# EAGLE board ESP32 WATCH_V1.0 (EAGLE 9.6.2)
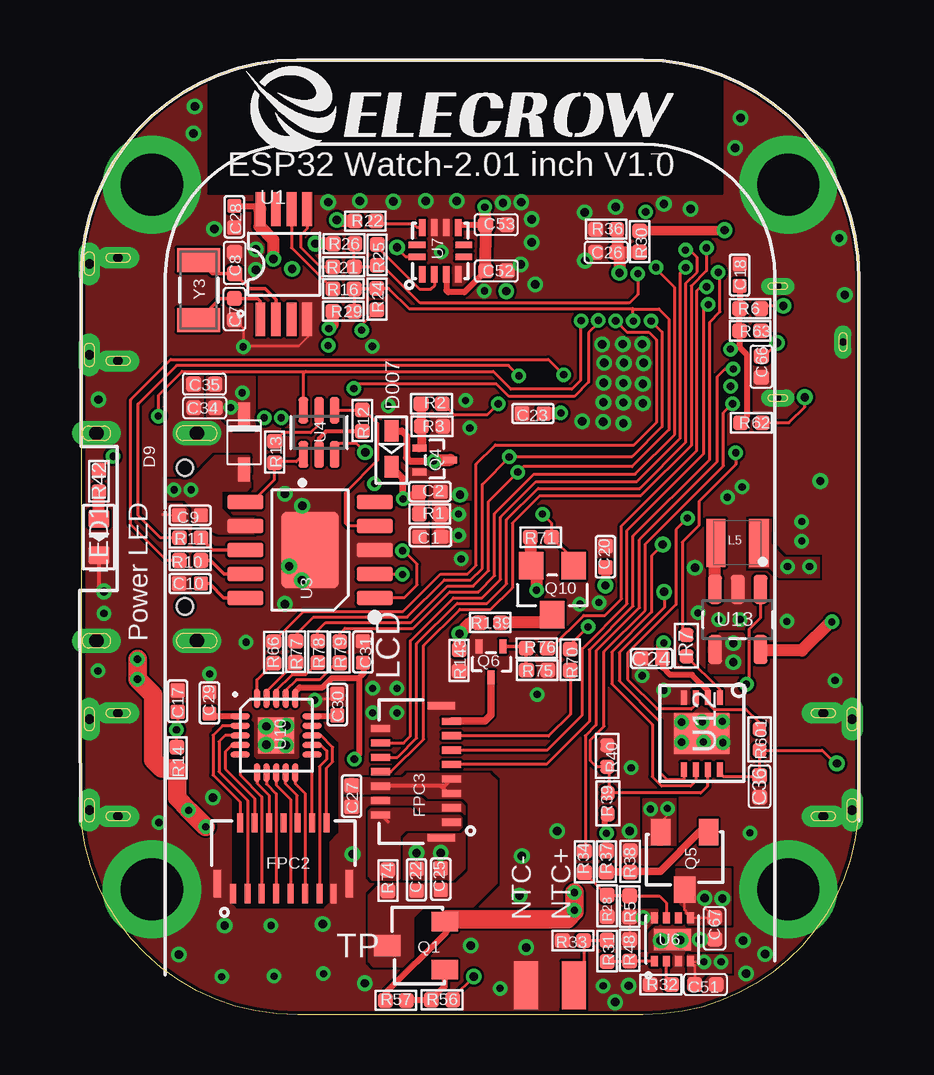
[diagram p5: board, top side]
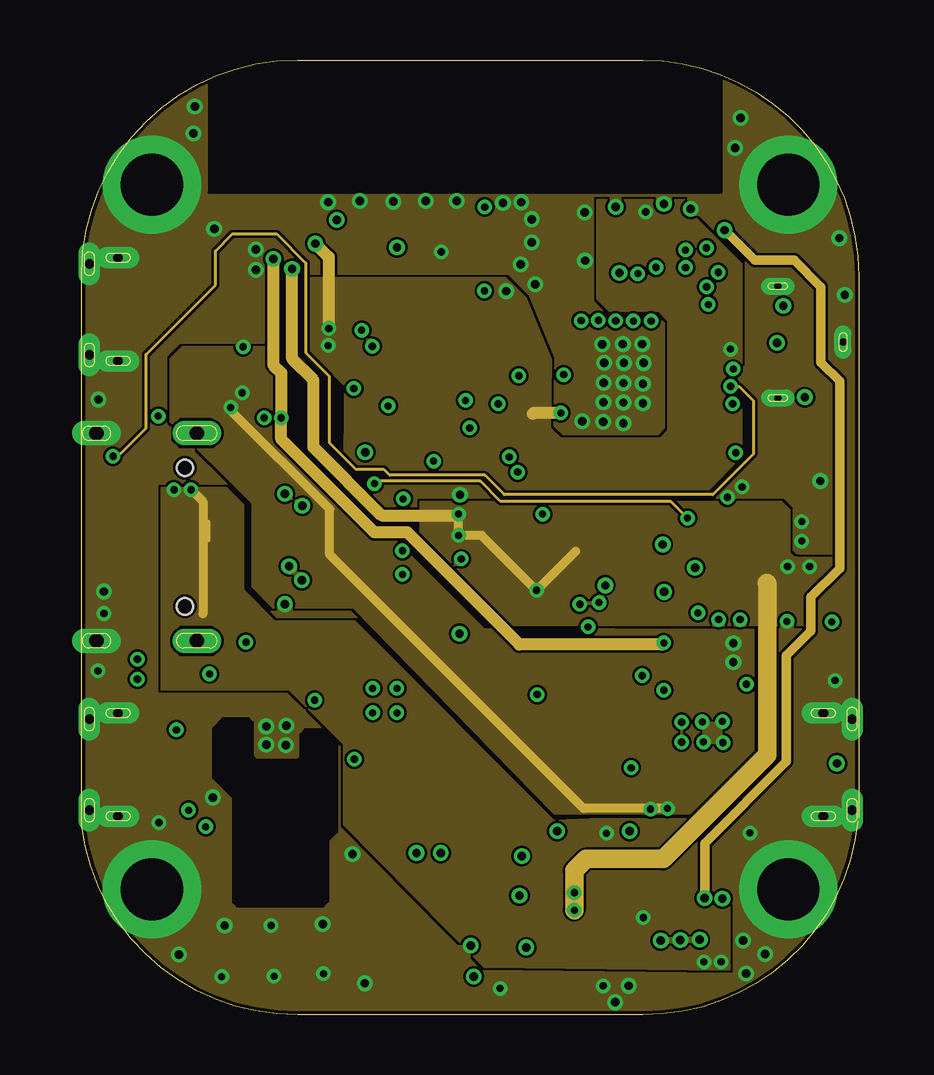
[diagram p6: board, inner layer Route2]
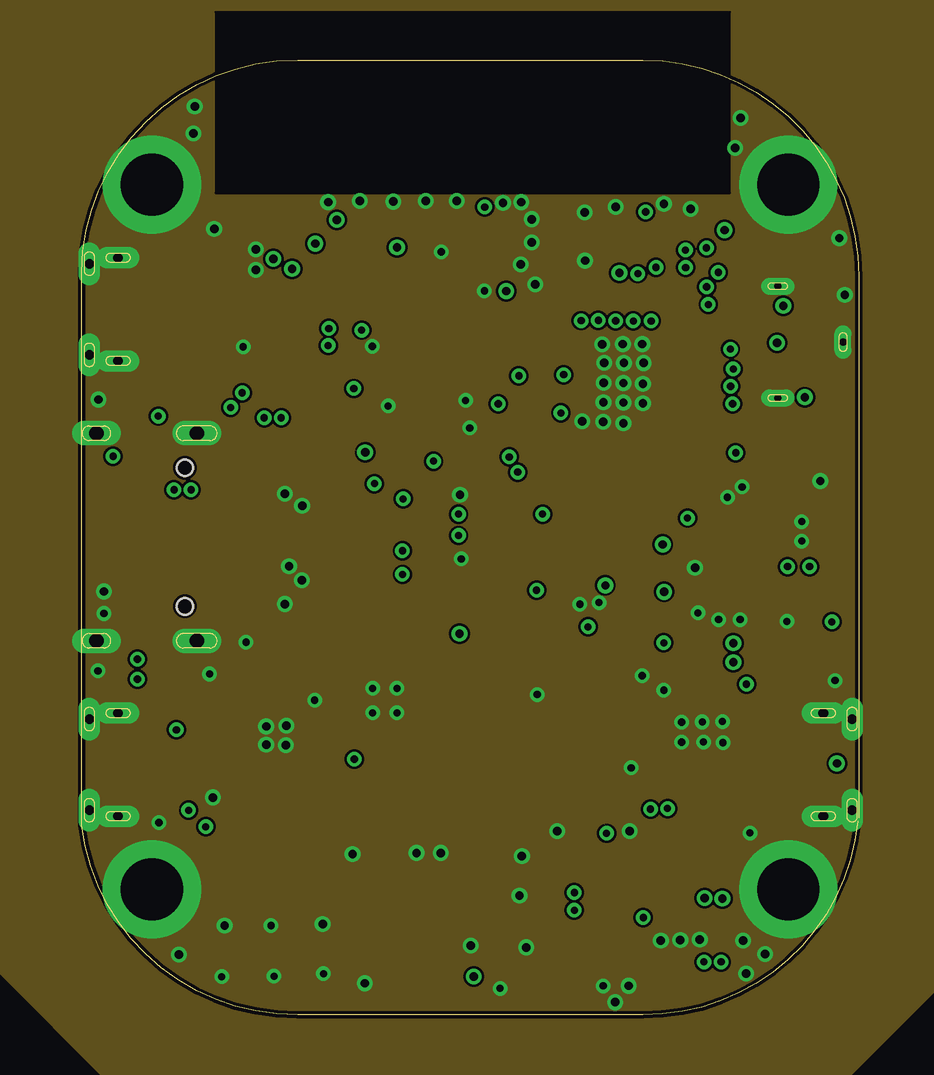
[diagram p7: board, inner layer Route15]
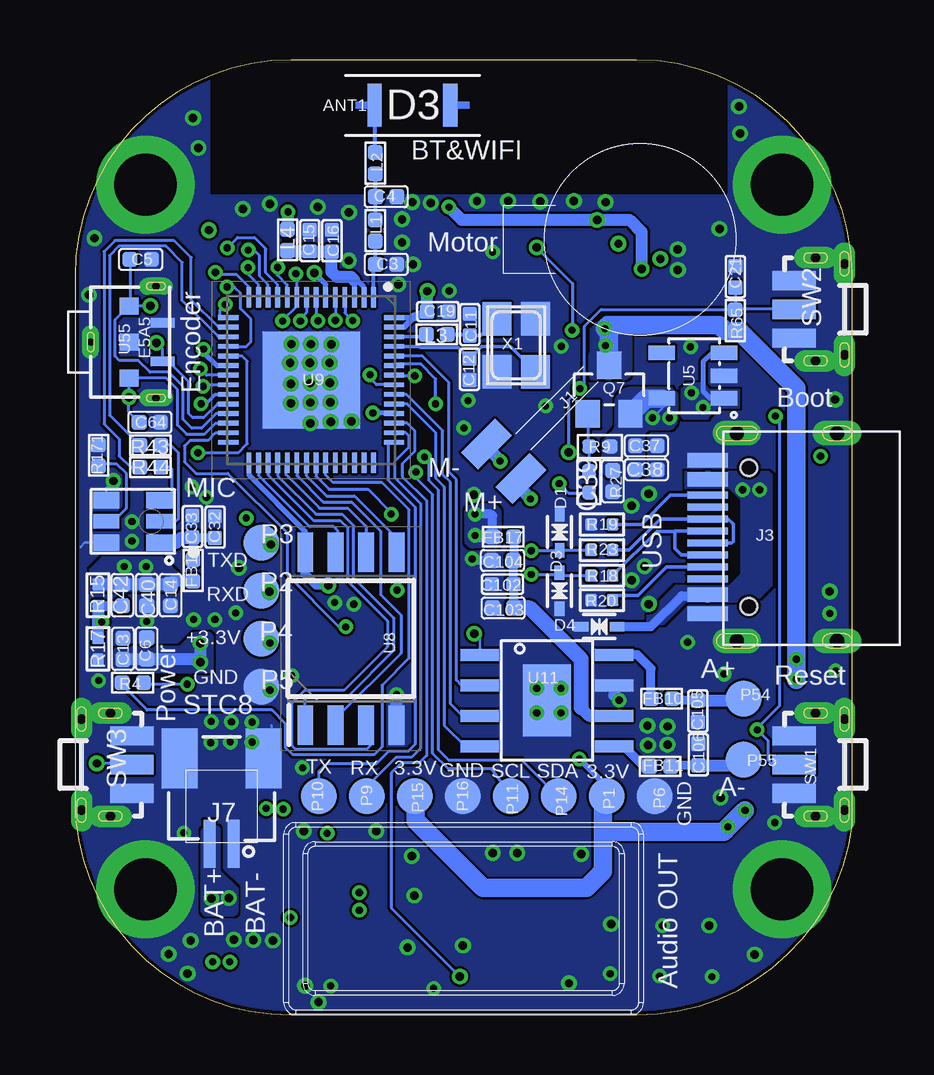
[diagram p8: board, bottom side, seen from below]

Size 32.4 x 39.8 mm. Coordinates in mm from the lower left corner, seen from the top.
Outline: 32.4,8.2 32.4,30.8 arc90 23.4,39.8 9,39.8 arc89 0,30.96
Outline: 0,30.96 0,7.9 arc83 9,0 23.4,0 arc85 32.36,8.08
Copper layers (1+2*15+16): Top 0.035mm / dielectric 1.5mm / Route2 0.035mm / dielectric 0.15mm / Route15 0.035mm / dielectric 0.2mm / Bottom 0.035mm
Design rules "default *": minimum track width 4mil, minimum drill 0.25mm, track to track 4mil, track to pad 4mil, pad to pad 4mil, via to via 4mil, smd to smd 4mil, copper to edge 6mil, drill to drill 4mil, minimum pad ring 6mil, minimum via ring 6mil, stop-mask expansion 4mil, vias tented up to drill 100mil, thermal gap 0mil
Net classes: 1 50R: width 0.156 mm, clearance 0.457 mm

## Footprints (pad centres in the part's own frame; a part is rotated, then mirrored left to right if it is on the bottom)
OA-D3 = smd 0.6 x 1.8: P$1 -1.575,0; P$2 1.575,0
C0402 = smd 0.6 x 0.6: 1 -0.45,0; 2 0.45,0
C0402' = smd 0.635 x 0.635: 1 0,0.445; 2 0,-0.445
C0402@1 = smd 0.6 x 0.6: 1 -0.45,0; 2 0.45,0
DISCRETE-NEW_C0402 = smd 0.635 x 0.635: 1 0,0.445; 2 0,-0.445
SOD-523_L1.2-W0.8-LS1.6-BI = smd 0.6 x 0.4: 1 -0.75,0; 2 0.75,0
SOD523 = smd 0.9 x 0.6: A 0.8,0; C -0.7,0
PICO-2.4_SOD-323 = smd 1.016 x 0.508: 1 1.137,0; 2 -1.137,0
R0402 = smd 0.635 x 0.635: 1 -0.445,0; 2 0.445,0
FPC-0.3HF-15P = smd 0.25 x 0.8: 1 -2.1,-1.5; 2 -1.8,1.452; 3 -1.5,-1.5; 4 -1.2,1.452; 5 -0.9,-1.5; 6 -0.6,1.452; 7 -0.3,-1.5; 8 0,1.452; 9 0.3,-1.5; 10 0.6,1.452; 11 0.9,-1.5; 12 1.2,1.452; 13 1.5,-1.5; 14 1.8,1.452; 15 2.1,-1.5 | smd 0.3 x 1.15: 16 2.75,-1.077; 17 -2.75,-1.077
FPC-SMD_HC-FPC-0.3-15P-FH10 = smd 0.3 x 0.8: 1 -2.1,-1.5; 2 -1.8,1.452; 3 -1.5,-1.5; 4 -1.2,1.452; 5 -0.9,-1.5; 6 -0.6,1.452; 7 -0.3,-1.5; 8 0,1.452; 9 0.3,-1.5; 10 0.6,1.452; 11 0.9,-1.5; 12 1.2,1.452; 13 1.5,-1.5; 14 1.8,1.452; 15 2.1,-1.5 | smd 0.3 x 1.15: 16 2.75,-1.077; 17 -2.75,-1.077
VIB_MOTOR_8MM = smd 1 x 2: P$1 1.083,-4.502; P$2 -0.956,-4.502
1X01_2.5MM = drill 2.6 pad 4.1: 1 0,0
KEVIN_3.0TYPEC-SMD = smd 0.3 x 1.7: A1 -3.35,0.5; A4 -2.55,0.5; A5 -1.25,0.5; A6 -0.25,0.5; A7 0.25,0.5; A8 1.25,0.5; A9 2.55,0.5; A12 3.35,0.5; B1 3.05,0.5; B4 2.25,0.5; B5 1.75,0.5; B6 0.75,0.5; B7 -0.75,0.5; B8 -1.75,0.5; B9 -2.25,0.5; B12 -3.05,0.5 | drill 0.6 pad 1.016 long: P$1 -4.325,-0.72; P$2 4.325,-0.72; P$3 -4.325,-4.9; P$4 4.325,-4.9 | hole 0.68: -2.89,-1.22; 2.89,-1.22
CONN-SMD_2P-P1.00_XUNPU_WAFER-SH1.0-2PWB = smd 0.5 x 2: 1 -0.5,1.85; 2 0.5,1.85 | smd 1.5 x 2.5: 3 1.75,-1.7; 4 -1.75,-1.7
L0402 = smd 0.635 x 0.635: 1 -0.445,0; 2 0.445,0
1008(2520) = smd 0.8 x 2: 1 -0.9,0; 2 0.9,0
LED-0603 = smd 0.762 x 0.889: + -0.762,0; - 0.762,0
SMD_6P_3.5X2.7MM = smd 0.7 x 1.1: 1 0.885,1.105; 3 -0.885,1.105; 4 -0.885,-1.105; 6 0.885,-1.105 | smd 0.6 x 1.1: 2 0,1.105; 5 0,-1.105
TEST_PAD-1.5MM = smd 1.5 x 1.5: P$1 0,0
H_1_2X1 = smd 1 x 2: 1 0.024,0
DFN8_SOT-23 = smd 1.1 x 0.8: 1 1.2,-1; 2 1.2,1 | smd 1.1 x 0.9: 3 -1.2,0
SOT-523 = smd 0.585 x 0.301: P$1 0.643,-0.5; P$2 0.643,0.5; P$3 -0.643,0
PMOS_SOT23 = smd 1.016 x 1.143: 1 -0.889,-1.016; 2 0.889,-1.016; 3 0,1.016
R0402' = smd 0.584 x 0.584: 1 -0.445,0; 2 0.445,0
0402 = smd 0.5 x 0.5: 1 -0.45,0; 2 0.45,0
SMD_4.1X3.2 = drill 0.4 pad 0.9 long: 1 -1.9,1.2; 2 1.9,1.2; 3 -2.15,0; 4 2.15,0 | smd 0.8 x 1.8: A1 -1.2,-0.9; A2 1.2,-0.9; B 0,-0.9
MSOP-8 = smd 0.406 x 1.397: P$1 -0.975,-2.3; P$2 -0.325,-2.3; P$3 0.325,-2.3; P$4 0.975,-2.3; P$5 0.975,2.3; P$6 0.325,2.3; P$7 -0.325,2.3; P$8 -0.975,2.3
ESOP-10-EP-150MIL = smd 1.5 x 0.6: 1 -2.7,2; 2 -2.7,1; 3 -2.7,0; 4 -2.7,-1; 5 -2.7,-2; 6 2.7,-2; 7 2.7,-1; 8 2.7,0; 9 2.7,1; 10 2.7,2 | smd 2.4 x 3.2: EP 0,0
SOP65P210X100-6N = smd 1.09 x 0.4: 1 -0.92,0.65; 2 -0.92,0; 3 -0.92,-0.65; 4 0.92,-0.65; 5 0.92,0; 6 0.92,0.65
SOT23-5 = smd 1.1 x 0.6: P$1 0,0; P$2 0,0.95; P$3 0,1.9; P$4 -2.6,1.9; P$5 -2.6,0
DFN2X2-8 = smd 0.45 x 0.3: P$1 -0.9,0.75; P$2 -0.9,0.25; P$3 -0.9,-0.25; P$4 -0.9,-0.75; P$5 0.9,-0.75; P$6 0.9,-0.25; P$7 0.9,0.25; P$8 0.9,0.75 | smd 0.9 x 1.55: P$9 0,0
LGA-12(2*2) = smd 0.7 x 0.28: P$1 -0.975,0.75; P$2 -0.975,0.25; P$3 -0.975,-0.25; P$4 -0.975,-0.75; P$7 0.975,-0.75; P$8 0.975,-0.25; P$9 0.975,0.25; P$10 0.975,0.75 | smd 0.28 x 0.7: P$5 -0.25,-0.975; P$6 0.25,-0.975; P$11 0.25,0.975; P$12 -0.25,0.975
SOIC127P790X216-8N = smd 1.65 x 0.65: 1 -3.6,1.905; 2 -3.6,0.635; 3 -3.6,-0.635; 4 -3.6,-1.905; 5 3.6,-1.905; 6 3.6,-0.635; 7 3.6,0.635; 8 3.6,1.905
QFN40P700X700X90-57N = smd 0.85 x 0.2: 1 -3.45,2.6; 2 -3.45,2.2; 3 -3.45,1.8; 4 -3.45,1.4; 5 -3.45,1; 6 -3.45,0.6; 7 -3.45,0.2; 8 -3.45,-0.2; 9 -3.45,-0.6; 10 -3.45,-1; 11 -3.45,-1.4; 12 -3.45,-1.8; 13 -3.45,-2.2; 14 -3.45,-2.6; 29 3.45,-2.6; 30 3.45,-2.2; 31 3.45,-1.8; 32 3.45,-1.4; 33 3.45,-1; 34 3.45,-0.6; 35 3.45,-0.2; 36 3.45,0.2; 37 3.45,0.6; 38 3.45,1; 39 3.45,1.4; 40 3.45,1.8; 41 3.45,2.2; 42 3.45,2.6 | smd 0.2 x 0.85: 15 -2.6,-3.45; 16 -2.2,-3.45; 17 -1.8,-3.45; 18 -1.4,-3.45; 19 -1,-3.45; 20 -0.6,-3.45; 21 -0.2,-3.45; 22 0.2,-3.45; 23 0.6,-3.45; 24 1,-3.45; 25 1.4,-3.45; 26 1.8,-3.45; 27 2.2,-3.45; 28 2.6,-3.45; 43 2.6,3.45; 44 2.2,3.45; 45 1.8,3.45; 46 1.4,3.45; 47 1,3.45; 48 0.6,3.45; 49 0.2,3.45; 50 -0.2,3.45; 51 -0.6,3.45; 52 -1,3.45; 53 -1.4,3.45; 54 -1.8,3.45; 55 -2.2,3.45; 56 -2.6,3.45 | smd 4.05 x 4.05: 57 0,0
QFN20-3*3 = smd 0.8 x 0.24: 1 -1.5,0.8; 2 -1.5,0.4; 3 -1.5,0; 4 -1.5,-0.4; 5 -1.5,-0.8; 11 1.5,-0.8; 12 1.5,-0.4; 13 1.5,0; 14 1.5,0.4; 15 1.5,0.8 | smd 0.24 x 0.8: 6 -0.8,-1.55; 7 -0.4,-1.55; 8 0,-1.55; 9 0.4,-1.55; 10 0.8,-1.55; 16 0.8,1.55; 17 0.4,1.55; 18 0,1.55; 19 -0.4,1.55; 20 -0.8,1.55 | smd 1.5 x 1.5: 21 0,0
NS4168-ESOP-8 = smd 1.6 x 0.5: 1 -2.8,1.905; 2 -2.8,0.635; 3 -2.8,-0.635; 4 -2.8,-1.905; 5 2.8,-1.905; 6 2.8,-0.635; 7 2.8,0.635; 8 2.8,1.905 | smd 2 x 3: 9 0,0
DFN8 = smd 0.61 x 0.25: 1 -1.5,0.75; 2 -1.5,0.25; 3 -1.5,-0.25; 4 -1.5,-0.75; 5 1.5,-0.75; 6 1.5,-0.25; 7 1.5,0.25; 8 1.5,0.75 | smd 1.7 x 2.3: P$9 0,0
SOT95P280X145-5N = smd 1.21 x 0.59: 1 -1.255,0.95; 2 -1.255,0; 3 -1.255,-0.95; 4 1.255,-0.95; 5 1.255,0.95
E5A5-2.35S10 = drill 0.3 pad 0.7 long: 1 -2.33,-1.12; 2 2.33,-1.12; 3 0,1.6 | smd 0.7 x 0.8: A -1.5,0; B 1.5,0; COM 0,0 | smd 0.4 x 1: D -0.8,-1.4; E 0.8,-1.4
ADAFRUIT_NX3225 = smd 1.4 x 1.2: 1 -1.1,-0.8; 2 1.1,-0.8; 3 1.1,0.8; 4 -1.1,0.8
NORDIC_NRF_XTAL_3215_N = smd 1 x 1.8: 1 -1.25,0; 2 1.25,0

## Placement (x,y rotation side)
ANT1  [OA-D3]  18.34,37.91 0 bottom
C1  100nF  [C0402]  14.54,19.93 0 top
C2  100nF  [C0402]  14.52,21.8 180 top
C3  2PF  [C0402']  19.43,31.28 90 bottom
C4  NC  [C0402']  19.43,34.1 90 bottom
C5  100nF  [C0402']  29.66,31.48 270 bottom
C6  10uF  [C0402']  29.41,15.26 0 bottom
C7  12pF/NC  [C0402']  6.38,29.41 0 top
C8  12pF/NC  [C0402']  6.38,31.34 180 top
C9  100nF  [C0402]  4.53,20.82 180 top
C10  1uF  [C0402]  4.53,17.97 180 top
C11  12pF  [C0402]  15.94,28.77 270 bottom
C12  12pF  [C0402]  15.95,26.91 90 bottom
C13  100nF  [C0402']  30.4,15.25 0 bottom
C14  100nF  [C0402']  28.42,17.49 180 bottom
C15  1uF  [C0402]  22.61,32.27 90 bottom
C16  100nF  [C0402]  21.69,32.26 270 bottom
C17  100nF  [C0402]  4.01,13.07 270 top
C18  100nF  [C0402]  27.44,30.83 270 top
C19  100nF  [C0402]  17.27,29.32 0 bottom
C20  100nF  [C0402]  21.84,19.09 270 top
C21  100nF  [C0402]  4.87,30.76 270 bottom
C22  100nF  [C0402]  13.96,5.63 270 top
C23  100nF  [C0402]  18.82,25.06 180 top
C24  100nF  [C0402]  23.77,14.85 180 top
C25  100nF  [C0402]  14.98,5.65 270 top
C26  100nF  [C0402']  21.88,31.79 90 top
C27  100nF  [C0402]  11.26,9.11 90 top
C28  100nF  [C0402]  6.37,33.26 270 top
C29  1uF  [C0402]  5.34,13 270 top
C30  1uF  [C0402]  10.66,12.93 90 top
C31  1uF  [C0402]  11.73,15.12 90 top
C32  10uF  [C0402@1]  26.56,20.33 90 bottom
C33  100nF  [C0402@1]  27.5,20.35 90 bottom
C34  10uF  [C0402']  5.14,25.3 90 top
C35  100nF  [C0402']  5.12,26.29 90 top
C36  100nF  [C0402']  28.27,9.51 180 top
C37  100nF  [C0402']  8.58,23.71 270 bottom
C38  10uF  [C0402']  8.58,22.72 270 bottom
C39  10uF  [C0402']  9.98,22.24 180 bottom
C40  10uF  [C0402']  29.41,17.49 180 bottom
C42  22pF  [C0402']  30.43,17.49 180 bottom
C51  100nF  [C0402']  26.01,1.26 270 top
C52  100nF  [C0402']  17.29,31 90 top
C53  100nF  [C0402']  17.29,32.93 90 top
C64  100nF  [C0402']  29.28,24.7 270 bottom
C66  100nF  [C0402']  28.34,27.01 180 top
C67  10uF  [DISCRETE-NEW_C0402]  26.39,3.6 0 top
C102  1uF  [C0402@1]  14.58,17.95 180 bottom
C103  47uF  [C0402']  14.55,16.96 270 bottom
C104  47uF  [C0402']  14.58,18.94 270 bottom
C105  1nF  [C0402@1]  6.43,12.66 90 bottom
C106  1nF  [C0402@1]  6.41,10.84 270 bottom
D1  LESD5D5.0CT1G-ES  [SOD-523_L1.2-W0.8-LS1.6-BI]  12.2,20.12 270 bottom
D3  LESD5D5.0CT1G-ES  [SOD-523_L1.2-W0.8-LS1.6-BI]  12.21,17.67 90 bottom
D4  LESD5D5.0CT1G-ES  [SOD-523_L1.2-W0.8-LS1.6-BI]  10.55,16.18 0 bottom
D007  RB521S-30  [SOD523]  12.92,23.53 90 top
D9  C917117_1N4148WS  [PICO-2.4_SOD-323]  6.78,23.86 270 top
FB1  0R/800mA  [R0402]  27.48,18.52 90 bottom
FB10  1K/磁珠  [R0402]  7.95,13.17 0 bottom
FB11  1K/磁珠  [R0402]  8.01,10.35 0 bottom
FB17  0R/800mA  [R0402]  14.55,19.93 180 bottom
FPC2  FPC-0.3HF-15P  [FPC-0.3HF-15P]  8.42,6.55 0 top
FPC3  HC-FPC-0.3-15P-FH10  [FPC-SMD_HC-FPC-0.3-15P-FH10]  13.93,10.13 90 top
J1  VIB_MOTOR_8MM  [VIB_MOTOR_8MM]  11.39,26.3 315 bottom
J2  [1X01_2.5MM]  2.93,5.23 0 top
J3  USB_TYPE-C_16PIN3.0USB  [KEVIN_3.0TYPEC-SMD]  5.53,19.91 90 bottom
J4  [1X01_2.5MM]  29.47,5.23 0 top
J5  [1X01_2.5MM]  2.93,34.6 0 top
J6  [1X01_2.5MM]  29.47,34.6 0 top
J7  ZX-SH1.0-2PLT1  [CONN-SMD_2P-P1.00_XUNPU_WAFER-SH1.0-2PWB]  26.29,8.98 180 bottom
L1  6.8nH  [L0402]  19.88,32.69 90 bottom
L2  0R  [L0402]  19.88,35.5 90 bottom
L3  24nH  [L0402]  17.32,28.36 180 bottom
L4  2nH  [L0402]  23.54,32.3 90 bottom
L5  2.2μH_C5179446  [1008(2520)]  27.35,19.67 0 top
LED1  RED  [LED-0603]  0.73,19.91 270 top
MIC3  LMD3526T261  [SMD_6P_3.5X2.7MM]  29.99,20.56 270 bottom
P1  TEST_PADPAD-1.5MM  [TEST_PAD-1.5MM]  10.23,9.11 270 bottom
P2  TEST_PADPAD-1.5MM  [TEST_PAD-1.5MM]  24.63,17.68 0 bottom
P3  TEST_PADPAD-1.5MM  [TEST_PAD-1.5MM]  24.63,19.68 0 bottom
P4  TEST_PADPAD-1.5MM  [TEST_PAD-1.5MM]  24.63,15.68 0 bottom
P5  TEST_PADPAD-1.5MM  [TEST_PAD-1.5MM]  24.63,13.68 0 bottom
P6  TEST_PADPAD-1.5MM  [TEST_PAD-1.5MM]  8.23,9.11 270 bottom
P7  H_1_2X1  [H_1_2X1]  20.5,1.23 0 top
P8  H_1_2X1  [H_1_2X1]  18.5,1.23 0 top
P9  TEST_PADPAD-1.5MM  [TEST_PAD-1.5MM]  20.23,9.11 270 bottom
P10  TEST_PADPAD-1.5MM  [TEST_PAD-1.5MM]  22.23,9.11 270 bottom
P11  TEST_PADPAD-1.5MM  [TEST_PAD-1.5MM]  14.23,9.11 270 bottom
P14  TEST_PADPAD-1.5MM  [TEST_PAD-1.5MM]  12.23,9.11 270 bottom
P15  TEST_PADPAD-1.5MM  [TEST_PAD-1.5MM]  18.23,9.11 270 bottom
P16  TEST_PADPAD-1.5MM  [TEST_PAD-1.5MM]  16.23,9.11 270 bottom
P54  TEST_PADPAD-1.5MM  [TEST_PAD-1.5MM]  4.53,13.18 0 bottom
P55  TEST_PADPAD-1.5MM  [TEST_PAD-1.5MM]  4.53,10.64 0 bottom
Q1  SI2301  [DFN8_SOT-23]  13.94,2.88 0 top
Q4  MMBT3904T  [SOT-523]  14.73,23.13 180 top
Q5  SI2301  [DFN8_SOT-23]  25.14,6.41 90 top
Q6  MMBT3904T  [SOT-523]  17.07,14.71 90 top
Q7  AO3401  [PMOS_SOT23]  10.13,26.06 0 bottom
Q10  AO3401  [PMOS_SOT23]  19.63,17.69 180 top
R1  10R  [R0402]  14.52,20.87 180 top
R2  1K  [R0402]  14.6,25.46 180 top
R3  10K  [R0402]  14.61,24.53 180 top
R4  10K  [R0402]  29.99,13.84 0 bottom
R5  5.1K  [R0402]  22.86,4.51 90 top
R6  5.1K  [R0402]  27.87,29.44 0 top
R7  22R  [R0402']  25.22,15.38 90 top
R9  10K  [R0402']  10.51,23.69 180 bottom
R10  0R  [R0402]  4.53,18.94 0 top
R11  0R  [R0402]  4.53,19.88 0 top
R12  10K  [R0402]  11.71,24.77 90 top
R13  10K  [R0402]  8.05,23.46 270 top
R14  10K  [R0402]  3.98,10.71 90 top
R15  100K  [0402]  31.44,17.49 270 bottom
R16  22R  [R0402]  10.92,30.27 180 top
R17  22.1K  [0402]  31.44,15.25 270 bottom
R18  22R  [0402]  10.44,18.3 0 bottom
R19  5.1K  [0402]  10.44,20.44 0 bottom
R20  5.1K  [0402]  10.44,17.29 180 bottom
R21  22R  [R0402]  10.93,31.18 180 top
R22  10K  [R0402]  11.83,33.08 0 top
R23  22R  [0402]  10.44,19.37 0 bottom
R24  22R  [R0402]  12.32,29.83 270 top
R25  22R  [R0402]  12.32,31.67 90 top
R26  5.1K  [R0402]  10.94,32.15 0 top
R27  1K  [R0402']  10.97,22.21 270 bottom
R28  10K  [R0402]  21.92,4.54 270 top
R29  5.1K  [R0402]  10.92,29.33 0 top
R30  100K  [R0402]  23.27,32.23 90 top
R31  62K  [R0402]  21.92,2.66 90 top
R32  2.8K  [R0402]  24.15,1.26 180 top
R33  100K 4250K NTC  [R0402]  20.49,3.09 0 top
R34  0R  [R0402]  20.97,6.37 90 top
R36  137K  [R0402]  21.87,32.74 180 top
R37  1K  [R0402]  21.88,6.39 90 top
R38  10K  [R0402]  22.87,6.39 270 top
R39  5.1K  [R0402']  21.94,8.8 90 top
R40  10K  [R0402']  21.92,10.78 270 top
R42  1K  [R0402]  0.73,22.24 90 top
R43  22R  [R0402]  29.26,23.74 180 bottom
R44  22R  [R0402]  29.26,22.82 0 bottom
R48  100K  [R0402]  22.86,2.68 270 top
R56  1K  [R0402]  15.03,0.62 0 top
R57  10M  [R0402]  13.1,0.6 180 top
R62  5.1K  [R0402]  27.93,24.68 0 top
R63  5.1K  [R0402]  27.88,28.51 0 top
R65  10K  [R0402]  4.88,28.93 90 bottom
R66  22R  [R0402]  8.01,15.11 270 top
R70  0R  [R0402]  20.37,14.8 270 top
R71  10K  [R0402]  19.15,19.9 180 top
R74  3.9R  [R0402]  12.78,5.59 270 top
R75  10K  [R0402]  19,14.37 180 top
R76  1K  [R0402]  18.98,15.28 0 top
R77  22R  [R0402]  8.92,15.13 270 top
R78  22R  [R0402]  9.85,15.13 270 top
R79  22R  [R0402]  10.77,15.11 270 top
R139  100K  [R0402]  17.04,16.35 0 top
R143  50K  [R0402]  15.74,14.77 90 top
R171  0R/NC  [R0402]  31.42,23.32 90 bottom
R601  10K  [R0402']  28.27,11.47 90 top
SW1  KEY_SMT  [SMD_4.1X3.2]  1.53,10.43 270 bottom
SW2  KEY_SMT  [SMD_4.1X3.2]  1.53,29.41 270 bottom
SW3  KEY_SMT  [SMD_4.1X3.2]  30.93,10.43 90 bottom
U1  PCF8563  [MSOP-8]  8.43,31.28 0 top
U3  CH340K  [ESOP-10-EP-150MIL]  9.53,19.37 180 top
U4  UMH3NTN  [SOP65P210X100-6N]  9.9,24.28 90 top
U5  C3021085/TPAP2112K-3.3TRG1  [SOT23-5]  5.34,25.69 0 bottom
U6  LGS4056HDA  [DFN2X2-8]  24.63,3.14 90 top
U7  SC7A20HTR  [LGA-12(2*2)]  14.96,31.84 90 top
U8  W25Q128JVSIQ  [SOIC127P790X216-8N]  20.9,15.68 90 bottom
U9  ESP32-S3R8  [QFN40P700X700X90-57N]  22.55,26.46 270 bottom
U10  CST5106L  [QFN20-3*3]  8.11,11.64 0 top
U11  NS4168  [NS4168-ESOP-8]  12.72,13.1 0 bottom
U12  STC8G1K08  [DFN8]  25.85,11.72 270 top
U13  MT3406_C22462728  [SOT95P280X145-5N]  27.36,16.47 270 top
U55  E5A5  [E5A5-2.35S10]  30.15,28.04 90 bottom
X1  40MHz(10ppm)  [ADAFRUIT_NX3225]  14.01,27.91 270 bottom
Y3  32.768K  [NORDIC_NRF_XTAL_3215_N]  4.89,30.21 270 top

## Tracks (layer width: path | path; a pad name or v marks a point on that pad's centre or on a via)
1
  cutout Route2: 5.48,11.93 5.48,9.88 6.33,9.03 6.33,4.68 6.5,4.51 10.06,4.51 10.27,4.72 10.27,7.24 10.66,7.63 10.66,11.35 10.12,11.89 9.33,11.89 9.15,11.7 9.15,11.68 9.13,11.67 9.13,10.74 9.01,10.62 7.3,10.62 7.13,10.79 7.13,12.19 6.97,12.35 5.88,12.35 5.48,11.94
  cutout Route2: 3.78,15.84 3.78,15.3 4.09,15 5.51,15 5.81,15.3 5.81,15.79 5.43,16.17 4.11,16.17
2
  cutout Route2: 3.78,24.5 3.78,23.97 4.09,23.66 5.51,23.66 5.81,23.97 5.81,24.45 5.43,24.83 4.11,24.83
3
  cutout Top: 5.48,11.91 5.48,9.86 6.33,9 6.33,4.65 6.5,4.49 10.06,4.49 10.27,4.69 10.27,7.22 10.66,7.6 10.66,11.33 10.12,11.86 9.33,11.86 9.15,11.68 9.15,11.66 9.13,11.64 9.13,10.72 9.01,10.59 7.3,10.59 7.13,10.76 7.13,12.16 6.97,12.32 5.88,12.32 5.48,11.91
3V3  (via drill 0.3, 0.35)
  Top 0.127: U7.P$7 15.71,32.59
  Top 0.254: Q1.2 15.21,3.81 15.21,3.44 12.66,0.89 R57.2 | C52.1 15.96,30.11 15.29,30.11 15.21,30.19 U7.P$3 | U7.P$7 15.82,32.93 C53.1
  Top 0.381: FB17.2 14.97,19.95 R1.1 v15.71,20.87 v15.72,20.87
  Top 0.508: v18.97,17.69 18.97,18.48 Q10.2 18.74,19.86 R71.2 | FB17.2 15.67,19.93 v15.72,19.98 | v16.81,33.67 16.82,33.66 C53.1 16.82,31.03 C52.1 | R22.1 10.69,33.09 v10.64,33.14
  Top 0.762: v20.54,5.09 v20.54,4.36 20.54,4.28 20.25,3.99 15.24,3.99 Q1.2
  Route2 0.381: 20.6,19.32 v18.97,17.69 16.68,19.98 v15.72,19.98 15.72,20.82 v15.72,20.87
  Route2 0.508: 15.72,20.82 12.52,20.82 9.67,23.66 9.67,26.45 8.78,27.34 v8.78,31.09
  Route2 0.762: v20.54,4.36 20.54,6.01 21.03,6.49 24.26,6.49 28.58,10.82 28.58,17.98 28.57,18
  Bottom 0.381: FB1.1 27.49,18.09 | FB17.2 14.99,20.8 15.06,20.87 v15.72,20.87
  Bottom 0.5: R15.1 C42.2 C40.2 C14.2 28.27,18.09 27.49,18.09 | v10.64,33.14 9.29,33.14 8.78,32.62 v8.78,31.09
  Bottom 0.508: FB17.2 15.67,19.93 v15.72,19.98 | v16.81,33.67 16.28,33.14 v10.64,33.14 10.59,33.08
  other vias: 29.43,18.68 30.35,18.68
  pour Top: 18.18,4.18 18.16,4.21 14.7,4.21
  pour Route2: 16.87,16.26 30.72,16.26 31.53,17.07 31.53,19.04 29.82,19.06 29.71,19.06 29.54,19.24 29.54,21.04 29.2,21.37 14.12,21.37 14.12,19.01
  pour Top: 14.88,19.52 16.15,19.52 16.15,21.3 14.63,21.3 14.63,19.52
  pour Bottom: 14.7,19.57 14.73,19.54 arc45 14.91,19.47 15.82,19.47 arc45 16,19.54 16.02,19.57 16.05,19.6 arc45 16.13,19.78 16.13,20.21 16.13,20.94 arc45 16.05,21.12 15.97,21.2 15.95,21.22 arc45 15.77,21.3 15.29,21.3 15.04,21.3 arc45 14.86,21.22 14.73,21.1 14.73,21.09 arc45 14.65,20.91 14.65,19.75
  pour Bottom: 28.14,17.67 31.75,17.67 31.77,18.55 31.26,19.06 28.77,19.06 28.14,18.43
  pour Top: 27.81,18.63 28.7,18.61 29.08,18.23 30.78,18.23 30.78,19.06 29.31,19.06 28.75,19.62 28.77,20.64 27.81,20.64
AUDIO_EN  (via drill 0.3)
  Top 0.12: v19.22,20.87 19.59,20.5 R71.1 20.52,18.98 Q10.1
  Bottom 0.12: U9.36 22.35,22.45 21.81,21.91 20.19,21.91 19.22,20.94 v19.22,20.87
AUDIO_VDD
  Top 0.508: Q10.3 19.3,16.35 R139.2
AUDIO_VDD1
  Bottom 0.381: FB17.1 14.11,18.96 C104.1 C102.1 14.11,17.93 C103.1
  Bottom 0.508: 11.3,12.79 10.97,12.46 U11.6
  Bottom 0.635: C103.1 13.43,16.96 11.3,14.82 11.3,12.79
BAT+  (via drill 0.35)
  Top 0.102: C67.1 26.21,4.23 | 26.21,4.23 25.98,4.46 v25.98,4.87 | 26.21,4.23 26.21,3.87 26.04,4.04 U6.P$5 25.19,4.24 25.19,4.33 25.14,4.37 Q5.3
  Top 0.4: R30.2 26.79,32.68 v26.82,32.71
  Top 0.508: R30.2 23.34,32.6
  Route2 0.4: v25.98,4.87 25.98,7.15 29.38,10.56 29.38,14.98 30.41,16 30.41,17.41 31.61,18.61 31.61,26.42 30.83,27.19 30.83,30.33 29.71,31.46 28.07,31.46 v26.82,32.71
  other vias: 26.72,4.84
  pour Bottom: 26.44,7.84 26.88,7.84 arc-90 27.13,7.58 27.13,4.39 arc-90 26.88,4.14 25.85,4.14 arc-90 25.6,4.39 25.6,5.25 26.34,5.99 26.34,7.74
  pour Top: 25.29,3.77 27.07,3.77 27.07,6.06 24.79,6.06 24.79,4.79 25.29,4.28
BAT_ADC  (via drill 0.35)
  Top 0.254: R30.1 | 22.33,31.77 C26.2
  Top 0.5: R36.1 22.33,32.73 22.33,31.77 | 23.25,31.79 C26.2 22.42,31.68 v22.42,30.93
  Top 0.508: 23.25,31.79 R30.1 | R36.1
  Bottom 0.203: U9.6 21.95,30.45 v22.42,30.93
BL_EN  (via drill 0.3)
  Top 0.12: R76.2 19.57,15.28 20.94,16.65 21.83,16.65 22.52,17.34 22.52,20.38 25.65,23.51 25.65,30.18 25.81,30.34 v26.06,30.34
  Bottom 0.12: U9.18 25.26,27.86 25.07,28.06 25.07,29 25.5,29.43 25.5,30.07 25.77,30.34 v26.06,30.34
CHRG  (via drill 0.3)
  Top 0.12: v27.17,26.92 26.82,26.92 26.49,26.58 26.49,23.04 23.26,19.81 23.26,16.98 21.45,15.16 21.45,12.08 21,11.63 21,6.84 R34.2
  Bottom 0.12: U9.21 26.92,26.66 v27.17,26.92
CHRG_1
  Top 0.12: 20.97,5.91 R34.1 R28.1 22.83,4.98 R5.2 24.09,4.95 24.38,4.66 U6.P$7
D+
  Bottom 0.152: R23.2 9.3,19.37 8,20.67 J3.B6 5.18,20.66 4.96,20.45 4.96,19.74 5.04,19.66 J3.A6
D-
  Bottom 0.15: 7.4,20.15 7.8,20.15
  Bottom 0.152: J3.A7 7.4,20.16 7.4,20.15 7.4,19.45 7.12,19.16 J3.B7 | R18.2 8.14,20.15 7.8,20.15
DISPLAY_EN  (via drill 0.35)
  Top 0.12: R56.2 15.48,0.71 v16.35,1.59
  Bottom 0.12: U9.45 18.56,24.67 18.25,24.36 18.25,23.47 18.76,22.97 18.76,22.44 17.74,21.43 17.74,10.81 18.05,10.5 18.79,10.5 19.22,10.07 19.22,4.46 v16.35,1.59
DISPLAY_VDD
  Top 0.152: 15.71,9.83 FPC3.7
  Top 0.156: FPC3.7 15.12,9.53 14.98,9.53 | 14.98,9.53 FPC3.6 | FPC3.5 15.28,9.23 14.98,9.53
  pour Top: 12.16,2.02 13.74,2.02 13.84,2.12 13.84,4.05 14.25,4.46 16.28,4.46 17.32,5.5 17.32,9.74 17.01,10.05 13.59,10.05 13.38,9.84 10.97,9.84 10.92,9.79 10.92,9.29 10.97,9.23 14.25,9.23 14.45,9.03 15.9,9.03 16.13,8.8 16.13,5.98 15.59,5.45 12.44,5.45 11.96,4.97 11.96,2.22
DTR
  Top 0.12: U4.4 10.57,25.21 R12.2 11.78,25.21 12.35,24.64 12.35,23.12 10.99,21.76 10.99,20.5 11.12,20.37 U3.4
E_BUTTON  (via drill 0.35)
  Top 0.12: R63.2 28.5,28.51 v29,28.01 28.46,27.46 C66.2
  Bottom 0.12: v29,28.01 28.75,27.75 U55.D 28.52,27.24 27.67,26.39 27.67,25.06 27.49,24.89 27.04,24.89 26.46,25.46 U9.24
EC04_A  (via drill 0.35)
  Top 0.12: R62.2 29.5,24.68 30.16,25.34 v30.16,25.74
  Bottom 0.12: U9.26 26.54,24.66 27.01,24.2 27.75,24.2 28.13,24.57 28.13,26.06 28.61,26.54 U55.A v30.15,25.75 v30.16,25.74 30.16,25.13 C64.2
EC04_B  (via drill 0.35)
  Top 0.12: R6.2 28.44,29.55 v29.26,29.55
  Bottom 0.12: 30.02,29.55 v29.26,29.55 | C5.2 30.11,29.64 30.02,29.55 | 30.02,29.55 29.99,29.53 U55.B 30.16,29.54 30.73,28.97 30.73,27.45 30.56,27.27 29.76,27.27 29.27,26.79 28.49,26.79 27.9,26.19 27.9,24.81 27.54,24.45 27.13,24.45 26.51,25.06 U9.25
ESP32_EN  (via drill 0.3)
  Top 0.12: v20.83,28.94 20.82,28.93 20.82,26.45 20.44,26.07 17.9,26.07 17.17,26.81 9.34,26.81 | U4.6 9.25,26.72 9.34,26.81 | v3.2,24.96 3.2,25.82 4.19,26.81 9.34,26.81 | 3.97,12.52 C17.2 4.01,11.93 v3.96,11.88 3.96,11.18 R14.2
  Bottom 0.12: U9.4 21.15,29.26 v20.83,28.94 | v3.2,24.96 3.04,24.8 3.04,12.87 3.96,11.95 v3.96,11.88 3.5,11.42 3.5,10.61 3.3,10.4 2.45,10.4 SW1.B 2.51,10.43
ESP_POWER_CTL  (via drill 0.3)
  Top 0.12: v25.26,20.71 24.78,20.22 24.78,17.1 22.76,15.08 22.76,13.98 24.01,12.74 25.42,12.74 25.6,12.92 U12.3
  Route2 0.12: v25.26,20.71 24.57,21.4 17.47,21.4 16.63,22.24 12.32,22.24 v12.21,22.14
  Bottom 0.12: v12.21,22.14 11.83,21.76 10.98,21.76 R27.2
GND  (via drill 0.3, 0.35)
  Top 0.102: C30.2 10.45,13.17 9.72,13.17 v9.72,13.12 | C7.2 6.75,28.59 6.75,28.06 6.93,27.88 9.05,27.88 9.44,28.27 9.44,28.95 U1.P$4 | C9.2 3.39,20.84
  Top 0.152: v13.97,6.75 v13.96,6.74 C22.1
  Top 0.156: LED1.- 0.73,17.85 v0.94,17.64
  Bottom 0.102: J7.4 24.2,11.01 24.2,12.06 | MIC3.4 31.1,21.95 v30.8,22.25 | MIC3.6 32,19.68 32.17,19.5
  Bottom 0.152: D3.1 12.09,16.81
  Bottom 0.381: C104.2 15.77,18.94 v15.84,19
  Bottom 0.508: U8.4 v19,13.35 | U11.7 9.92,13.32 v9.72,13.12
  other vias: 8.54,12.05 7.7,12.02 12.12,27.87 18.34,33.87 17.57,33.85 14.35,33.92 13,33.9 11.6,33.92 10.28,33.87 22.27,33.67 4.67,36.74 27.48,37.38 5.53,32.75 14.98,6.75 11.3,6.69 5.48,9.06 10.05,3.77 18.54,2.81 22.81,1.21 31.59,32.37 27.25,36.13 4.72,37.86 24.28,33.8 18.77,33.16 12.14,13.6 12.14,12.59 13.15,13.6 13.15,12.59 9.19,18.11 9.2,21.21 15.78,21.67 7.27,31.04 21.77,26.34 22.61,27.17 21.76,25.53 20.87,24.74 21.74,24.72 22.57,27.96 21.71,27.94 21.79,27.18 25.88,12.21 26.74,11.34 5.97,3.72 11.81,1.31 27.58,3.09 27.71,1.72 22.86,7.66 25.4,33.59 18.36,6.62 18.26,4.97 16.23,2.88 20.98,33.44 7.7,11.26 8.51,11.23 25.93,11.37 26.72,12.22 6.74,27.84 8.66,18.69 8.48,21.72 21.57,17.18 26.93,21.57 30.03,19.74 5.84,1.58 3.23,8.01 0.69,14.33 6.86,15.53 12.79,25.38 16.19,24.46 16.01,25.6 16.8,30.18 14.99,31.8 7.27,31.91 18.77,32.2 23.38,27.96 23.43,27.17 23.41,26.3 23.41,25.49 22.59,24.65 22.59,25.52 22.59,26.33 18.92,30.44 18.31,31.28 5.34,14.21 24.15,3.09 24.96,3.11 25.78,3.14 15.64,33.92 20.99,31.44 25.7,16.75 27.54,22 30.03,20.56 24.28,13.53 20.78,17.11 23.37,14.13 22.91,10.29 27.87,7.58 21.74,1.2 17.45,1.1 7.9,3.72 8.03,1.61 10.09,1.71 19.83,7.66 31.82,30.01 0.71,25.64 4.06,2.5 22.25,0.52 28.5,2.53 25.57,18.63 0.94,16.73 25.02,11.36 25.02,12.2 26.56,16.47 27.45,16.47 29.41,16.4 31.42,13.93 8.48,17.12
  pour Bottom (rank 3, no thermals): -0.13,9.08 -0.11,30.45 arc-90 9.22,39.79 23.51,39.79 arc-90 32.41,30.89 32.41,8.79 arc-90 23.6,-0.01 8.96,-0.01 arc-90
  pour Route15 (rank 3, no thermals): -4.17,43.09 37.58,43.09 37.58,3.01 31.05,-3.52 1.84,-3.52 -4.2,2.52
  pour Route2 (rank 3, no thermals): -0.13,9.13 -0.12,30.66 arc-90 9.03,39.81 23.52,39.81 arc-90 32.41,30.92 32.41,8.71 arc-90 23.69,-0.01 9,-0.01 arc-90
  pour Top (rank 3, no thermals): -0.1,9.09 -0.08,30.45 arc-90 9.28,39.81 23.53,39.81 arc-90 32.41,30.94 32.41,8.73 arc-90 23.67,0 8.99,0 arc-90
  cutout Bottom: 5.25,34.26 26.71,34.26 26.71,40.63 5.25,40.63
GND1
  cutout Bottom: 5.25,34.24 26.71,34.24 26.71,40.63 5.25,40.63
GND2
  cutout Top: 5.28,34.23 26.73,34.23 26.73,40.63 5.28,40.63
GND3
  cutout Route2: 5.29,34.27 26.69,34.27 26.69,40.6 5.29,40.6
GND4
  cutout Route15: 5.58,34.25 27.04,34.25 27.04,41.8 5.58,41.8
I2SOUT_LRCK
  Bottom 0.12: U11.2 16.28,13.73 16.5,13.95 16.5,22.31 16.81,22.62 16.81,26.35 17.92,27.46 U9.52
I2SOUT_SCLK
  Bottom 0.12: U9.48 18.58,25.86 17.07,24.35 17.07,22.51 16.75,22.2 16.75,12.96 16.25,12.46 U11.3
I2SOUT_SD
  Bottom 0.12: U9.47 18.56,25.46 17.35,24.25 17.35,22.35 17.01,22.01 17.01,12.07 16.13,11.19 U11.4
IO0_BOOT  (via drill 0.3, 0.35)
  Top 0.12: v21.55,28.94 21.55,28.83 21.14,28.43 21.14,26.37 20.54,25.77 17.83,25.77 17.31,26.29 11.54,26.29 v11.35,26.1 | v11.82,23.45 11.46,23.81 10.65,23.81 10.55,23.71 U4.3
  Bottom 0.12: 4.73,30.46 C21.2 R65.2 | U9.5 v21.55,28.95 v21.55,28.94 | SW2.B 4.85,29.41 R65.2 | R65.2 4.9,29.4 10.47,29.4 11.18,28.7 11.18,26.28 v11.35,26.1 11.84,25.62 11.84,23.46 v11.82,23.45
IO7_LCD_SCK  (via drill 0.3)
  Top 0.12: FPC3.10 13.17,10.73 13.98,11.53 13.98,15.47 15.66,17.15 16.91,17.15 17.73,17.97 17.73,20.64 19.03,21.94 23.27,21.94 25.19,23.86 25.19,30.49 25.67,30.96 25.67,31.57 25.36,31.87 v25.18,31.87
  Bottom 0.12: U9.12 24.35,30.45 24.7,30.8 24.7,31.33 24.7,31.65 24.93,31.87 v25.18,31.87
IO8_LCD_MOSI  (via drill 0.3)
  Top 0.12: FPC3.12 13.43,11.33 13.71,11.61 13.71,15.59 15.5,17.38 16.7,17.38 17.47,18.15 17.47,20.74 18.95,22.22 23.15,22.22 24.96,24.04 24.96,30.93 v25.18,31.15
  Bottom 0.12: U9.13 24.75,30.43 25.16,30.84 25.16,31.13 v25.18,31.15
IO9_LCD_CS  (via drill 0.3)
  Top 0.12: FPC3.9 15.44,10.45 19.4,10.45 21.17,12.22 21.17,15.21 23,17.04 23,19.95 26.19,23.14 26.19,28.87 26.62,29.3 26.62,30.88 v26.55,30.94
  Bottom 0.12: U9.14 25.15,30.33 25.69,30.87 26.47,30.87 v26.55,30.94
IO10_LCD_D/C  (via drill 0.3)
  Top 0.12: FPC3.11 19.4,11.02 20.88,12.49 20.88,15.26 22.74,17.13 22.74,20.19 25.93,23.38 25.93,29.51 26.03,29.61 v26.13,29.61
  Bottom 0.12: U9.15 26.36,29.06 26.36,29.07 26.36,29.38 v26.13,29.61
LCD_POWER_DET  (via drill 0.3)
  Top 0.12: v27.27,23.42 27.27,22.94 25.74,21.4 25.74,20.4 25.04,19.7 25.04,16 R7.2
  Bottom 0.12: U9.19 25.44,27.46 25.22,27.24 25.22,23.81 25.6,23.42 v27.27,23.42
LCD_RESET  (via drill 0.3)
  Top 0.12: FPC3.8 12.89,10.12 14.26,11.49 14.26,15.38 15.78,16.9 17.06,16.9 17.96,17.8 17.96,20.49 19.1,21.64 23.32,21.64 25.42,23.73 25.42,30.37 26.06,31.01 v26.06,31.97
  Bottom 0.12: U9.11 23.96,29.92 23.96,30.44 24.45,30.93 24.45,31.87 24.45,31.93 24.91,32.4 25.62,32.4 v26.06,31.97
LED  (via drill 0.3)
  Top 0.12: R42.2 v1.32,23.28
  Route2 0.12: v27.06,26.2 27.08,26.17 27.44,26.17 28.01,25.6 28.01,23.38 26.32,21.68 17.63,21.68 16.81,22.49 12.85,22.49 12.59,22.75 11.43,22.75 10.33,23.84 10.33,26.61 9.34,27.6 9.34,31.33 8.12,32.55 6.3,32.55 5.58,31.84 5.58,30.42 2.69,27.52 2.69,24.45 1.51,23.28 v1.32,23.28
  Bottom 0.12: U9.22 27,26.26 v27.06,26.2
LEDA
  Top 0.152: 12.77,8.03 FPC3.2
  pour Top: 12.11,5.63 13.2,5.63 13.28,5.7 13.28,7.46 13.53,7.71 15.74,7.71 15.87,7.84 15.87,8.19 15.77,8.29 14.02,8.29 13.74,8.57 12.06,8.57 11.96,8.47 11.96,5.78
LEDK
  Top 0.305: FPC3.15 15.43,12.24 16.81,12.24 17.07,12.5 Q6.P$3
MIC_MCLK
  Bottom 0.12: U9.17 26.02,28.28 26.44,28.28 27.92,29.77 27.92,31.35 28.6,32.03 30.57,32.03 30.96,31.65 30.96,25 R43.2
MIC_SD2
  Bottom 0.12: U9.16 26.41,28.66 27.56,29.8 27.56,31.56 28.27,32.27 30.73,32.27 31.19,31.82 31.19,24.63 30.56,24 30.56,23.3 30.08,22.82 R44.1
MIC_VDD_3V3
  Bottom 0.381: C33.1 26.59,19.9 C32.1 27.48,19.88 FB1.2
  Bottom 0.508: C33.1 27.53,19.88 27.98,19.88 28.18,19.68 MIC3.1
N$1
  Bottom 0.156: ANT1.P$1 19.88,37.91 L2.2
N$2
  Top 0.381: R2.2 14.15,24.54 R3.2 14.17,23.71 Q4.P$1
N$3  (via drill 0.3)
  Top 0.3: D007.C 13.38,22.38 13.38,21.53 v13.41,21.5
  Top 0.381: 14.07,20.88 R1.2
  Top 0.508: R1.2 14.08,21.8 C2.2 13.77,21.5 v13.41,21.5
  Bottom 0.508: J1.P$1 13.8,22.34 13.8,21.89 v13.41,21.5
N$4
  Top 0.152: Q6.P$1 18.46,15.35 R76.1 18.54,14.38 R75.2
N$5
  Bottom 0.156: U9.1 19.95,31.2 C3.1 19.87,32.23 L1.1
N$6
  Bottom 0.156: L1.2 19.87,33.15 C4.1 19.87,35.04 L2.1
N$7
  Top 0.152: Y3.1 5.45,30.89 C8.1 7.01,30.26 7.65,30.26 8.1,29.81 U1.P$2
N$8
  Top 0.152: U1.P$1 7.45,29.74 7.34,29.86 C7.1 5.79,29.86 Y3.2
N$9  (via drill 0.3)
  Top 0.3: D007.A 13.36,24.33 13.54,24.15 13.54,23.22 13.68,23.08 v14.68,23.08
  Top 0.508: v14.68,23.08 14.73,23.13 Q4.P$3
  Bottom 0.508: J1.P$2 15.21,23.75 15.21,23.64 14.68,23.1 v14.68,23.08
N$10  (via drill 0.3)
  Top 0.12: v27.72,13.78 27.83,13.89 27.83,16.06 28.32,16.55 U13.1
  Bottom 0.12: R4.2 29.49,13.78 v27.72,13.78
N$11
  Top 0.5: U13.3 26.43,19.65 L5.1
N$12
  Top 0.152: U3.9 5.95,18.37 5.38,18.94 R10.2
N$14
  Top 0.152: U3.8 5.47,19.37 5.47,19.38 R11.2
N$15
  Top 0.156: U4.2 9.9,24.03 10.2,24.32 R12.1
N$16
  Top 0.152: U3.10 5.94,17.37 5.33,17.97 C10.1
N$17
  Top 0.12: R13.1 8.4,24.26 9.56,24.26 9.9,24.6 U4.5
N$18
  Bottom 0.12: MIC3.2 28.22,20.56 28.09,20.69 28.09,23.42 28.41,23.74 R43.1
N$19
  Bottom 0.152: U9.54 17.86,28.26 L3.2
N$20
  Top 0.254: R57.1 14.56,0.6 R56.1 15.14,1.18 Q1.1
N$21
  Bottom 0.152: J3.A5 7.75,18.66 8.94,17.48 9.77,17.48 9.96,17.29 R20.1
N$22
  Bottom 0.152: U9.53 18.03,27.86 17.99,27.81 16.41,27.81 C12.2 15.46,27.85 14.25,27.85 X1.3
N$23
  Bottom 0.152: X1.1 15.5,28.32 C11.2 15.99,28.36 L3.1
N$24
  Top 0.12: FPC3.13 19.47,11.62 20.37,12.52 R70.2
N$25  (via drill 0.3)
  Top 0.5: U13.5 28.36,15.18 30.04,15.18 31.23,16.38 v31.28,16.38
  Bottom 0.406: R15.2 C42.1
  Bottom 0.5: R15.2 31.44,16.54 | 31.44,16.54 v31.28,16.38 | R17.1 31.44,16.54
N$26
  Bottom 0.12: R171.1 31.31,22.98 30.67,22.98 30.27,22.58 30.27,21.11 30.82,20.56 MIC3.5
N$28
  Top 0.254: U10.1 5.44,12.44 C29.2
N$29
  Top 0.12: 26.6,13.41 U12.1 26.6,13.55 R7.1
N$30
  Top 0.254: C30.1 10.61,12.43 9.63,12.43 U10.15
N$31
  Top 0.12: U10.20 7.31,13.97 R66.2
N$32
  Top 0.12: U10.19 7.71,13.5 7.74,13.5 R77.2
N$33
  Bottom 0.152: R19.2 8.79,20.44 7.57,21.66 6.03,21.66 J3.B5
N$35
  Top 0.508: LED1.+ 0.7,20.7 0.7,21.77 R42.1
N$36
  Top 0.12: U7.P$10 13.98,32.82 13.84,32.96 12.4,32.96 R22.2
N$37
  Top 0.12: U10.18 8.11,13.51 8.8,14.19 9.36,14.19 R78.2
N$39
  Top 0.12: 8.74,33.59 U1.P$6 8.75,31.97 10.46,30.27 R16.2
N$40
  Top 0.12: U1.P$5 9.4,32.76 9.14,32.5 9.14,32 9.96,31.18 R21.2
N$41  (via drill 0.3, 0.35)
  Top 0.12: U7.P$12 13.52,31.59 13.16,31.96 v13.16,31.98 | R24.2 11.68,28.75 v11.68,28.54
  Bottom 0.12: v13.16,31.98 11.66,30.49 11.66,28.56 v11.68,28.54
N$42
  Top 0.12: 14.66,30.87 U7.P$2 14.73,30.84 14.73,30.4 14.57,30.24 14.1,30.24 12.32,32.01 R25.2
N$45
  Bottom 0.381: FB10.1 8.39,14.43 8.96,15 U11.8
N$46
  Bottom 0.381: U11.5 9.52,11.19 8.68,10.35 FB11.1
N$48
  Bottom 0.12: R44.2 28.43,22.82 28.38,22.77 28.38,21.75 28.68,21.45 MIC3.3
N$51  (via drill 0.35)
  Top 0.508: R143.2 15.74,15.86 v15.76,15.88 16.23,16.35 R139.1
  Bottom 0.102: U11.1 15.52,15.64 v15.76,15.88
N$60
  Top 0.12: R31.1 21.94,2.24 R48.2 U6.P$1
N$61
  Top 0.12: P7.1 20.8,1.5 20.94,1.65 R33.2 21.9,3.09 R31.2
N$63
  Top 0.12: R32.1 24.38,1.47 U6.P$2
  Top 0.254: U6.P$2
N$67
  Top 0.102: 22.75,5.95 R38.2
  Top 0.305: R37.1 22.75,5.95 | R38.2 22.91,5.99 24.13,5.99 25.76,7.62 Q5.1
N$76
  Top 0.12: R79.2 10.62,14.66 9.92,13.96 8.97,13.96 8.51,13.51 U10.17
N$122
  Bottom 0.12: Q7.1 11.02,23.75 R9.2 10.96,23.01 R27.1
POWER_CTL
  Bottom 0.12: U9.37 21.95,23.13 21.95,22.5 21.65,22.19 19.6,22.19 18.47,21.06 18.47,14.86 19.6,13.73 19.6,11.17 19.94,10.83 23.31,10.83 23.61,11.13 23.61,12.12 24.19,12.7 29.4,12.7 30.44,13.74 R4.1
POWER_KEY  (via drill 0.35)
  Top 0.12: v31.49,10.48 31.43,10.48 30.88,11.03 R601.1 C36.2 28.23,9.92 26.76,9.92 26.6,10.07 U12.8
  Bottom 0.12: SW3.B 30.08,10.48 v31.49,10.48
RTS
  Top 0.12: U3.6 7.11,21.37 8.05,22.31 R13.2 8.05,23.05 8.95,23.05 U4.1
RX
  Bottom 0.12: U9.44 18.61,24.26 18.49,24.13 18.49,23.64 19.07,23.05 19.07,22.39 17.98,21.3 17.98,11.11 18.36,10.73 19.01,10.73 20.23,9.52 P9.P$1
RXD0_H  (via drill 0.3)
  Top 0.12: v18.23,26.63 17.8,27.07 3.96,27.07 2.36,25.47 2.36,20.81 3.29,19.88 R11.1
  Bottom 0.12: U9.50 19.07,26.63 v18.23,26.63
RXD_STC  (via drill 0.35)
  Top 0.12: U12.5 25.1,9.79 24.43,9.79 24.1,10.12 24.1,12.23 22.42,13.92 22.42,15.1 24.29,16.97 v24.29,17.63
  Bottom 0.12: P2.P$1 24.57,17.63 v24.29,17.63
S1
  Top 0.12: U10.2 5.88,12.04 5.48,11.65 5.48,10 6.62,8.86 FPC2.2
S2
  Top 0.12: U10.3 5.99,11.64 5.74,11.39 5.74,10.12 6.92,8.94 FPC2.3
S3
  Top 0.12: U10.4 6.27,11.24 5.99,10.96 5.99,10.25 7.22,9.03 FPC2.4
S4
  Top 0.12: U10.5 6.61,9.99 7.52,9.09 FPC2.5
S5
  Top 0.12: U10.6 7.31,9.65 7.82,9.15 FPC2.6
S6
  Top 0.12: U10.7 7.71,9.62 8.12,9.21 FPC2.7
S7
  Top 0.12: U10.8 8.11,9.58 8.72,8.98 FPC2.9
S8
  Top 0.12: FPC2.10 9,8.02 9,9.14 8.51,9.62 U10.9
S9
  Top 0.12: U10.10 8.91,9.64 9.32,9.23 FPC2.11
S10
  Top 0.12: FPC2.12 U10.11
S11
  Top 0.12: U10.12 9.64,11.22 10.01,11.22 10.22,11.01 10.22,10.65 9.92,10.35 FPC2.13
S12
  Top 0.12: FPC2.14 10.22,10.29 10.47,10.54 10.47,11.15 9.98,11.64 U10.13
SCL  (via drill 0.3)
  Top 0.12: R78.1 9.85,16.02 10.18,16.35 13.74,16.35 15.26,17.87 16.33,17.87 16.97,18.51 16.97,21.4 v18.19,22.62 18.42,22.85 22.95,22.85 24.5,24.39 24.5,28.99 24.08,29.41 22.98,29.41 | R29.2 R16.1 12.3,30.27 R24.1 12.81,30.28 13.65,29.44 22.98,29.44 22.98,29.41 | v23,28.92 22.98,28.94 22.98,29.41
  Bottom 0.12: 14.73,9.51 P11.P$1 15.03,10.25 16.84,10.25 17.49,10.9 17.49,21.68 18.19,22.38 v18.19,22.62 | U9.8 22.75,29.27 23,29.01 v23,28.92
SDA  (via drill 0.3)
  Top 0.12: R77.1 8.92,15.83 9.67,16.58 13.57,16.58 15.12,18.12 16.23,18.12 16.71,18.61 16.71,22.11 17.83,23.23 v17.83,23.25 17.85,23.27 22.96,23.27 24.2,24.51 24.2,28.46 v23.75,28.92 | v23.19,30.89 23.19,30.03 22.83,29.67 14.11,29.67 12.6,31.18 12.37,31.18 | 11.39,31.2 R21.1 | R21.1 11.45,31.26 | 12.37,31.18 R25.1 | R21.1 11.37,32.13 R26.2 | R21.1 12.37,31.18
  Bottom 0.12: P14.P$1 12.66,9.49 13.77,10.61 16.81,10.61 17.24,11.03 17.24,21.87 17.65,22.29 17.65,23.07 v17.83,23.25 | v23.19,30.89 23.15,30.85 U9.9 23.15,29.55 23.75,28.95 v23.75,28.92
SPICLK
  Bottom 0.12: U8.6 20.27,20.36 21.03,21.12 22.21,21.12 23.61,22.52 23.61,22.96 U9.33
SPICS0
  Bottom 0.12: U8.1 22.81,13.14 22.69,13.26 21.04,13.26 19.1,15.21 19.1,16.53 20.78,18.21 20.78,20.39 21.26,20.87 22.36,20.87 23.95,22.46 U9.32
SPID
  Bottom 0.12: U8.5 19.05,19.28 19.05,19.92 20.75,21.63 21.91,21.63 22.76,22.47 U9.35
SPIHD
  Bottom 0.12: U9.30 24.75,22.49 22.61,20.35 21.63,20.35 21.44,20.16 21.44,19.34 U8.7
SPIQ
  Bottom 0.12: U8.2 21.54,12.35 18.82,15.07 18.82,16.67 19.66,17.51 19.66,20.16 20.87,21.38 22.05,21.38 23.15,22.48 U9.34
SPIWP
  Bottom 0.12: 20.09,12.46 20.09,11.91 | 20.09,11.91 20.09,11.22 20.23,11.07 23.22,11.07 23.36,11.22 23.36,12.99 22.83,13.52 21.19,13.52 19.38,15.34 19.38,16.41 21.04,18.07 21.04,20.3 21.35,20.6 22.45,20.6 24.35,22.5 U9.31 | 20.09,11.91 U8.3
TE  (via drill 0.3)
  Top 0.12: v21.12,16.17 20.37,15.43 R70.1
  Bottom 0.12: U9.27 26.02,24.24 26.56,24.24 26.86,23.94 27.59,23.94 27.83,23.71 27.83,23.05 27.35,22.57 26.03,22.57 23.57,20.11 23.57,18.35 21.38,16.17 v21.12,16.17
TOUCH_INT  (via drill 0.3)
  Top 0.12: R66.1 9.26,16.8 13.4,16.8 14.97,18.37 16.09,18.37 16.45,18.73 16.45,22.95 17.26,23.75 23.03,23.75 23.96,24.68 23.96,28.14 23.65,28.45 22.75,28.45 v22.27,28.93
  Bottom 0.12: U9.7 22.35,29 v22.27,28.93
TOUCH_RST  (via drill 0.3)
  Top 0.12: R79.1 10.77,15.89 10.98,16.1 13.82,16.1 15.35,17.63 16.54,17.63 17.22,18.3 17.22,20.89 18.86,22.53 23.07,22.53 24.74,24.2 24.74,30.32 23.95,31.1 v23.95,31.15
  Bottom 0.12: U9.10 23.55,30.42 23.96,30.83 v23.96,31.15 v23.95,31.15
TX
  Bottom 0.12: P10.P$1 22.23,10.14 21.92,10.45 19.86,10.45 19.32,10.99 18.51,10.99 18.22,11.28 18.22,21.16 19.33,22.26 19.33,23.86 U9.43
TXD0_H  (via drill 0.3)
  Top 0.12: v20.1,26.68 19.46,27.32 3.73,27.32 2.05,25.64 2.05,20.43 3.54,18.94 R10.1
  Bottom 0.12: U9.49 19.84,26.26 20.1,26.52 v20.1,26.68
TXD_STC  (via drill 0.35)
  Top 0.12: U12.6 25.6,9.75 25.4,9.54 24.18,9.54 23.8,9.92 23.8,12.1 22.11,13.79 22.11,15.12 23.77,16.78 23.77,19.13 v24.24,19.6
  Bottom 0.12: P3.P$1 24.55,19.6 v24.24,19.6
USB_D+  (via drill 0.3)
  Top 0.12: U3.1 11.99,17.39 13.46,17.39 13.99,17.92 13.99,18.78 13.43,19.34 v13.38,19.34
  Bottom 0.12: R23.1 D1.2 12.23,19.34 v13.38,19.34
USB_D-  (via drill 0.3)
  Top 0.12: U3.2 13.37,18.37 v13.38,18.35
  Bottom 0.12: R18.1 12.08,18.3 D3.2 12.28,18.35 v13.38,18.35
USB_POWER_DET  (via drill 0.3)
  Top 0.12: 21.99,9.25 25.82,9.25 26.1,9.54 U12.7 | 21.99,9.25 R39.2 | 21.99,9.25 21.99,10.26 R40.2 21.47,10.34 21.22,10.58 21.22,11.46 21.78,12.02 21.78,15.13 23.51,16.86 23.51,19.62 26.76,22.87 26.76,25.1 27.13,25.47 v27.14,25.47
  Bottom 0.152: U9.23 26.55,25.86 26.95,25.47 v27.14,25.47
VBUS  (via drill 0.3)
  Top 0.102: C51.2 25.56,2.06 U6.P$4 25.42,2.2 v25.95,2.2 | U6.P$8 23.86,4.07 R5.1 R48.1 | R37.2 21.88,7.04
  Top 0.254: 21.81,8.22 21.81,7.64 v21.88,7.57 | v21.88,7.57 v21.89,7.56 | R37.2 v21.88,7.57
  Top 0.305: R39.1 21.81,8.22
  Route2 0.152: 5.3,20.56 5.3,19.78
  Route2 0.381: v4.57,21.88 5.07,21.39 5.07,16.73
  Bottom 0.381: D4.2 8.39,16.18 7.11,17.46 6.13,17.46 J3.A4
  other vias: 3.86,21.88 26.66,2.2 23.42,4.05
  pour Bottom: 6.9,17.24 4.01,17.24 3.35,17.9 3.35,22.49 3.48,22.62 6.98,22.62 6.98,21.96 5.13,21.96 4.64,21.48 4.64,18.35 5.12,17.88 7.36,17.88 8.56,16.68 8.56,16.42 8.43,16.29 7.85,16.29
  pour Route2: 6.75,21.25 6.04,21.96 3.32,21.96 3.32,13.55 8.66,13.55 10.92,11.29 10.92,7.93 16.77,2 27.02,1.87 27.02,8.14 21.18,8.14 19.71,8.09 11.4,16.39 8.06,16.39 6.75,17.7
  pour Top: 3.5,22.29 3.5,21.47 4.31,21.46 4.62,21.15 4.62,20.56 4.7,20.48 5.7,20.07 7.19,20.07 7.19,20.69 6.24,20.69 5.84,21.09 5.84,21.86 6.91,21.86 7.06,22.01 7.06,23.2 6.98,23.28 5.56,23.28 4.57,22.29
  pour Top: 25.29,0.98 25.29,2.5 27.07,2.5 27.07,1.74 26.06,1.74 25.8,1.49 25.8,0.98
  pour Top: 22.5,2.76 23.26,2.76 23.52,2.76 23.52,3.52 24.02,4.03 24.02,4.07 24.02,4.37 22.59,4.37 22.5,4.28
VCC3V3  (via drill 0.3, 0.35)
  Top 0.203: R63.1 27.34,28.6
  Top 0.25: C18.2 R6.1 | v27.05,27.75 27.13,27.82 27.43,27.82
  Top 0.254: C31.1 11.76,14.65 11.76,14.22 11.57,14.03 | 8.91,13.45 U10.16 8.91,13.2 8.91,13.46 9.1,13.65 10.06,13.65 10.44,14.03 11.57,14.03 | R6.1 R63.1 27.43,27.82 27.74,27.52 27.74,24.93 R62.1 | 11.57,14.03 11.57,10.86 v11.38,10.66
  Top 0.5: C23.1 19.29,25.08 v19.99,25.08 | R14.1 3.96,10.29 3.98,10.18 3.98,10.17
  Top 0.508: R26.1 v9.75,32.15 | R29.1 10.47,28.77 v10.31,28.61
  Top 0.762: v5.18,7.83 4.49,8.52 | 4.49,8.52 3.98,9.03 3.98,10.17 | v4.47,8.52 4.49,8.52 | v2.33,14.82 v2.33,13.98 2.99,13.32 2.99,10.62 3.35,10.26 R14.1
  Route2 0.5: v19.99,25.08 18.84,25.08 18.82,25.06 | v9.75,32.15 10.31,31.58 v10.31,28.61
  Bottom 0.2: U9.46 19.12,25.08 v19.99,25.08 | U9.20 26.48,27.06 27.05,27.63 v27.05,27.75
  Bottom 0.229: U9.56 18.29,29.06 | 18.29,29.06 18.26,29.09 | U9.55 18.69,28.66 18.29,29.06
  Bottom 0.254: v11.38,10.66 10.21,9.49 10.21,9.47
  Bottom 0.381: 18.26,29.09 C19.1
  Bottom 0.508: v23.52,33.47 23.54,33.44 L4.2 | C19.1 17.72,30.15 v17.71,30.16
  Bottom 0.762: 10.21,9.47 P1.P$1 10.4,8.94 10.4,7.84 | P15.P$1 18.2,9.08 18.2,8.1 15.4,5.3 11.07,5.3 10.4,5.97 10.4,7.84 | v4.47,8.52 5.23,7.76 5.36,7.63 10.18,7.63 10.4,7.84 | 2.33,13.96 v2.33,13.98 v2.33,14.82 2.33,17.39 2.33,17.4 2.33,26.12 4.7,28.49 R65.1 5.28,28.49 5.53,28.74 10.17,28.74 v10.31,28.61 10.13,28.43 Q7.3
  other vias: 10.28,27.9
  pour Route2: 9.47,30.7 9.42,30.65 9.42,27.78 10.97,26.23 10.94,22.23 11.45,21.73 25.98,21.73 27.53,23.28 27.53,31.28 25.17,33.64 25.17,33.95 21.48,33.95 21.48,29.86 21.98,29.36 24.04,29.36 24.46,28.94 24.46,24.35 24.13,24.02 19.99,24.02 19.56,24.44 19.58,27.3 18.53,29.87 17.7,30.7
  pour Bottom: 9.53,26.51 10.87,26.51 arc45 10.89,27.67 10.89,28.59 10.71,28.77 arc45 10.35,28.92 9.52,28.92 arc45 9.3,28.83 9.22,28.74 9.22,26.89 arc45 9.34,26.58 arc45
VDD3P3
  Bottom 0.203: U9.2 20.35,30.32 20.75,30.72 20.75,30.62 U9.3
  Bottom 0.508: L4.1 23.51,31.82 C15.1 21.89,31.81 | 21.89,31.81 C16.2 | 21.89,31.81 21.71,31.63 21.71,30.97 21.48,30.75 20.88,30.75 20.75,30.62
VDD3V3  (via drill 0.3, 0.35)
  Top 0.102: 7.38,33.66 U1.P$8
  Top 0.12: U12.2 26.1,12.99 26.36,12.74 27.71,12.74 28.24,12.2 28.24,11.91 R601.2
  Top 0.25: C24.1 24.23,14.47 24.53,14.17 25.45,14.17 26.1,13.51 U12.2
  Top 0.254: C28.1 7.32,33.71 7.38,33.66
  Top 0.5: U1.P$8 7.42,33.55 7.42,32.86 8,32.29 v8,31.51 | v24.28,15.5 24.22,15.44 C24.1
  Route2 0.5: v8,31.51 8,27.09 8.33,26.76 v8.33,24.88
  Route2 0.508: v24.28,15.5 24.21,15.43 18.26,15.43 13.59,20.11 12.21,20.11 8.33,23.99 v8.33,24.88
  Bottom 0.102: U5.P$5 7.94,25.27 v8.33,24.88
  Bottom 0.5: P4.P$1 24.45,15.5 v24.28,15.5
  Bottom 0.762: U5.P$5 8.6,25.69 Q7.2
  other vias: 7.62,24.88
  pour Bottom: 8.68,22.52 arc45 8.99,22.39 10.22,22.39 arc45 10.38,22.8 10.38,23.92 9.95,24.35 arc-45 9.88,24.53 9.88,25.48 arc45 9.73,25.84 9.59,25.98 arc45 9.23,26.13 7.54,26.13 7.35,25.93 arc45 7.31,25.85 7.31,24.86 arc45 7.46,24.5 7.49,24.47 arc45 7.61,24.42 8.51,24.42 8.67,24.26 arc-45 8.68,24.22
VDD_SPI  (via drill 0.35)
  Top 0.381: C20.2 v21.84,17.9
  Bottom 0.203: U8.8 22.81,20.15 25.15,22.5 U9.29
  Bottom 0.381: v21.84,17.9 22.34,17.9 22.81,18.36 U8.8
VIB_EN  (via drill 0.3)
  Top 0.12: v17.37,25.47 16.91,25.01 15.55,25.01 15.09,25.46 R2.1
  Bottom 0.12: U9.51 19.05,27.12 17.98,27.12 17.37,26.51 v17.37,25.47
VIN  (via drill 0.3, 0.35)
  Top 0.102: Q5.2 24.14,8.02 24.58,8.45 v24.43,8.6 | C34.2 5.52,25.31 v6.22,25.31
  Route2 0.102: 13.69,16.04 10.56,19.16
  Route2 0.381: v24.43,8.6 20.93,8.6 10.35,19.18 10.35,21.07 6.16,25.26 v6.22,25.31
  Bottom 0.203: U5.P$3 5.84,27.59 6.22,27.22 6.22,25.99 5.92,25.69 U5.P$1
  Bottom 0.5: C13.2 27.29,14.81 v27.17,14.7 v27.17,15.48
  other vias: 23.72,8.57 6.7,25.92
  pour Route2: 19.69,8.4 25.39,8.4 28.04,11.05 28.04,16.03 27.66,16.03 16.77,16.08 10.59,22.26 10.59,26.07 8.84,27.83 4.2,27.83 3.7,27.33 3.7,24.73 7.11,21.32 7.11,17.84 7.97,16.98 11.32,16.98
  pour Top: 23.42,7.08 24.79,7.08 24.79,8.98 23.42,8.98
  pour Bottom: 7.1,26.08 7.1,24.95 7.01,24.86 6.04,24.86 6.02,24.88 6.02,24.91 5.61,25.31 4.72,25.31 4.72,26.04 5.96,26.04 6.22,26.3 6.88,26.3
  pour Top: 5.23,24.96 5.86,24.93 6.42,24.37 7.08,24.37 7.21,24.5 7.21,26.58 5.23,26.58
  pour Top: 26.16,15.43 26.16,14.26 27.63,14.26 27.63,15.81 27.58,15.86 26.59,15.86
  pour Bottom: 26.69,14.29 30.65,14.29 30.83,14.47 30.83,15.13 30.63,15.33 28.01,15.33 27.43,15.91 26.82,15.91 26.69,15.79
VOLN
  Bottom 0.381: FB11.2 7.53,10.39 C106.2
  Bottom 0.508: P55.P$1 4.77,10.39 C106.2
VOLP
  Bottom 0.381: FB10.2 7.44,13.11 C105.2
  Bottom 0.508: C105.2 4.6,13.11 P54.P$1

## Text on the board
tPlace: ESP32 Watch-2.01 inch V1.0 | D9 | Power LED | LCD | U10 | NTC- | NTC+ | TP
bPlace: BT&WIFI | Motor | SW2 | Boot | Encoder | M- | MIC | M+ | USB | TXD | RXD | +3.3V | Reset | A+ | GND | STC8 | Power | 3.3V | SDA | SCL | GND | 3.3V | RX | TX | SW3 | A- | GND | BAT- | BAT+ | Audio OUT
tNames: U1